# Altium project QUTMS_BrakeLight.PrjPcb
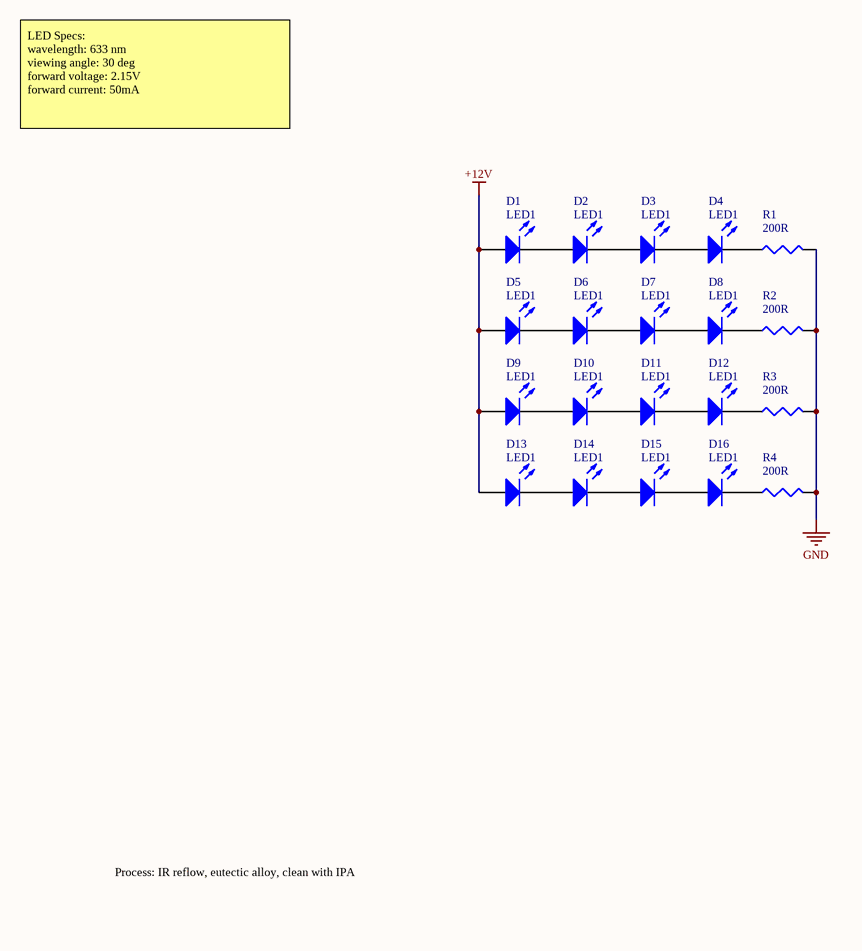
[diagram p0: Taillight.SchDoc]
1 sheet, 20 parts. Net scope: global (net labels, ports and power ports of the same name join across sheets).
Board file: Taillight.PcbDoc

## Sheet Taillight.SchDoc: QEV2 Brake Light
size A4; CheckedBy: JFF; Author: DGF; CompanyName: QUT Motorsport; DrawnBy: DGF; Engineer: DGF; Organization: QUT; Address1: 2 George St; Address2: Brisbane City; Address3: QLD; Address4: Australia 4000; DocumentNumber: 001; Revision: 1; Material: 2 layer, 2oz Cu, 1.2mm FR4; Finish: HASL, Black resist, White silk, Routed

### Parts
D1  LED1  [PLCC-4-1-LED]
D2  LED1  [PLCC-4-1-LED]
D3  LED1  [PLCC-4-1-LED]
D4  LED1  [PLCC-4-1-LED]
D5  LED1  [PLCC-4-1-LED]
D6  LED1  [PLCC-4-1-LED]
D7  LED1  [PLCC-4-1-LED]
D8  LED1  [PLCC-4-1-LED]
D9  LED1  [PLCC-4-1-LED]
D10  LED1  [PLCC-4-1-LED]
D11  LED1  [PLCC-4-1-LED]
D12  LED1  [PLCC-4-1-LED]
D13  LED1  [PLCC-4-1-LED]
D14  LED1  [PLCC-4-1-LED]
D15  LED1  [PLCC-4-1-LED]
D16  LED1  [PLCC-4-1-LED]
R1  value 200R  [1210]  (hidden comment: Comment)
R2  value 200R  [1210]  (hidden comment: Comment)
R3  value 200R  [1210]  (hidden comment: Comment)
R4  value 200R  [1210]  (hidden comment: Comment)

### Nets
+12V: D1.1 D5.1 D9.1 D13.1
GND: R1.2 R2.2 R3.2 R4.2
NetD1_2: D1.2 D2.1
NetD2_2: D2.2 D3.1
NetD3_2: D3.2 D4.1
NetD4_2: D4.2 R1.1
NetD5_2: D5.2 D6.1
NetD6_2: D6.2 D7.1
NetD7_2: D7.2 D8.1
NetD8_2: D8.2 R2.1
NetD9_2: D9.2 D10.1
NetD10_2: D10.2 D11.1
NetD11_2: D11.2 D12.1
NetD12_2: D12.2 R3.1
NetD13_2: D13.2 D14.1
NetD14_2: D14.2 D15.1
NetD15_2: D15.2 D16.1
NetD16_2: D16.2 R4.1

### Notes on the sheet
- LED Specs:
  wavelength: 633 nm
  viewing angle: 30 deg
  forward voltage: 2.15V
  forward current: 50mA
- Process: IR reflow, eutectic alloy, clean with IPA
- Notes:
- Material:
- Finish:
- Drawn:
- Engineer:
- Checked:
- Designer:
- Title
- Size:
- Date:
- A4
- Number:
- Time:
- Revision:
- Sheet
- of
- Approved:
- File:

### Library data of the parts
D1-D16 = LED1: LS E63F-DBFA-1 Red Topled; Published: 8-Jun-2000; LatestRevisionDate: 08-Jul-2005; LatestRevisionNote: Mech Layer 1 removed.; PackageReference: LED-1; Publisher: Altium Limited; PackageDescription: LED; 2 Leads
R1-R4 = Res3: Resistor; Published: 8-Jun-2000; LatestRevisionDate: 29-May-2009; LatestRevisionNote: IPC-7351 Footprint Added.; PackageReference: J1-0603; Publisher: Altium Limited; PackageDescription: Chip Resistor